# Altium schematic sheet Embarcado.SchDoc
size A4
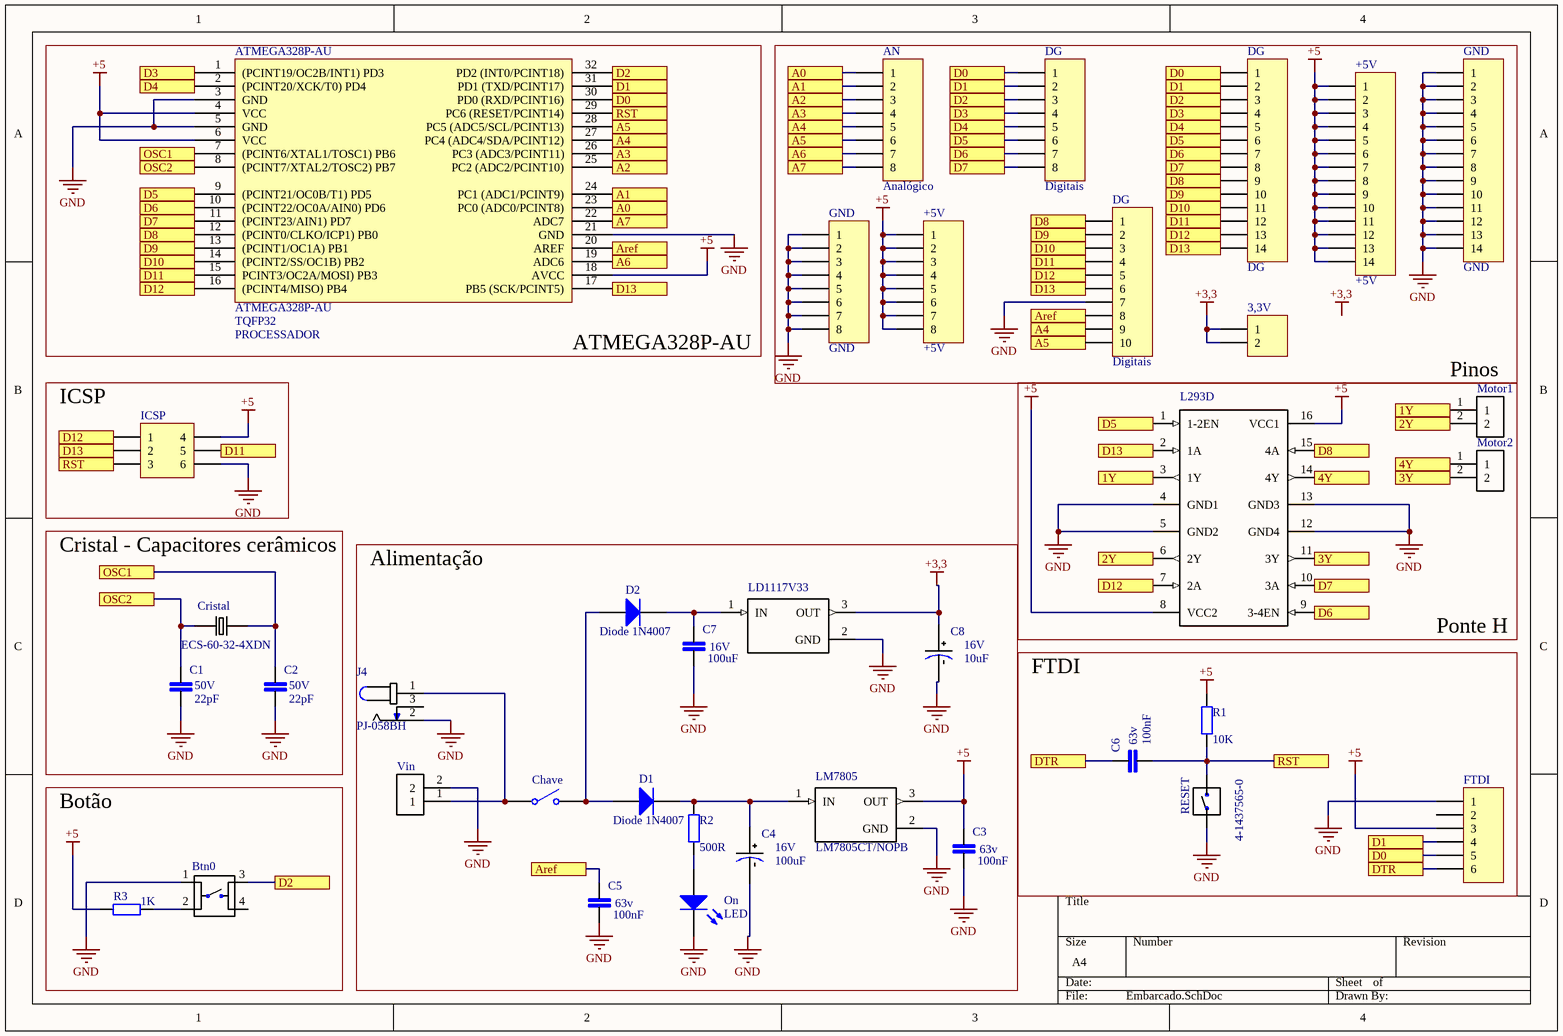
[diagram p0: Embarcado.SchDoc]

## Parts
(Parts that share a designator on the sheet are numbered #1, #2 ... from top to bottom, then left to right.)
3,3V  (no value)  [HDR1X2]
+5V#1  +5V  [HDR1X14]
+5V#2  +5V  [HDR1X8]
AN  Analógico  [HDR1X8]
ATMEGA328P-AU  PROCESSADOR  [TQFP80P900X900X120-32N]
Btn0  (no value)  [SW_FSM8JH]
C1  (no value)  [LEADED_DECOUPLING_CAP(.1)]
C2  (no value)  [LEADED_DECOUPLING_CAP(.1)]
C3  (no value)  [LEADED_DECOUPLING_CAP(.1)]
C4  (no value)  [CAPPRD200W50D500H1100B_ECA-1HM220(Primary)]
C5  (no value)  [LEADED_DECOUPLING_CAP(.1)]
C6  (no value)  [LEADED_DECOUPLING_CAP(.1)]
C7  (no value)  [LEADED_DECOUPLING_CAP(.1)]
C8  (no value)  [CAPPRD200W50D500H1100B_ECA-1HM220(Primary)]
Chave  (no value)  [SPST-2]
Cristal  ECS-60-32-4XDN  [XTAL_ECS-60-32-4XDN]
D1  Diode 1N4007  [DO-41]
D2  Diode 1N4007  [DO-41]
DG#1  Digitais  [HDR1X8]
DG#2  DG  [HDR1X14]
DG#3  Digitais  [HDR1X10]
FTDI  (no value)  [HDR1X6]
GND#1  GND  [HDR1X14]
GND#2  GND  [HDR1X8]
ICSP  (no value)  [HDR2X3_CEN]
J4  PJ-058BH  [CUI_PJ-058BH]
L293D  (no value)  [DIL16]
LD1117V33  (no value)  [TO254P1054X470X2600-3]
LM7805  LM7805CT/NOPB  [TO254P1054X470X2600-3]
Motor1  282837\-2  [TE_282837-2]  (value not drawn)
Motor2  282837\-2  [TE_282837-2]  (value not drawn)
On  LED  [LED-0]
R1  value 10K  [AXIAL-0.4]
R2  value 500R  [AXIAL-0.4]
R3  value 1K  [AXIAL-0.4]
RESET  4-1437565-0  [SW_4-1437565-0]
Vin  282837\-2  [TE_282837-2]  (value not drawn)

## Blocks framed on the sheet
ATMEGA328P-AU: ATMEGA328P-AU
Pinos: 3,3V +5V#1 +5V#2 AN DG#1-DG#3 GND#1 GND#2
ICSP: ICSP
Cristal - Capacitores cerâmicos: C1 C2 Cristal
Alimentação: C3-C5 C7 C8 Chave D1 D2 J4 LD1117V33 LM7805 On R2 Vin
Botão: Btn0 R3

## Ports
1Y, 2Y, 3Y, 4Y, A0, A1, A2, A3, A4, A5, A6, A7, Aref, D0, D1, D2, D3, D4, D5, D6, D7, D8, D9, D10, D11, D12, D13, DTR, OSC1, OSC2, RST

## Nets
+3,3: 3,3V.1 3,3V.2 C8.POS LD1117V33.3(OUT)
+5: +5V#1.1 +5V#1.2 +5V#1.3 +5V#1.4 +5V#1.5 +5V#1.6 +5V#1.7 +5V#1.8 +5V#1.9 +5V#1.10 +5V#1.11 +5V#1.12 +5V#1.13 +5V#1.14 +5V#2.1 +5V#2.2 +5V#2.3 +5V#2.4 +5V#2.5 +5V#2.6 +5V#2.7 +5V#2.8 ATMEGA328P-AU.4(VCC) ATMEGA328P-AU.6(VCC) ATMEGA328P-AU.18(AVCC) C3.1 FTDI.3 ICSP.4 L293D.8(VCC2) L293D.16(VCC1) LM7805.3(OUT) R1.2 R3.2
GND: ATMEGA328P-AU.3(GND) ATMEGA328P-AU.5(GND) ATMEGA328P-AU.21(GND) Btn0.1 C1.2 C2.2 C3.2 C4.NEG C5.2 C7.2 C8.NEG DG#3.7 FTDI.1 GND#1.1 GND#1.2 GND#1.3 GND#1.4 GND#1.5 GND#1.6 GND#1.7 GND#1.8 GND#1.9 GND#1.10 GND#1.11 GND#1.12 GND#1.13 GND#1.14 GND#2.1 GND#2.2 GND#2.3 GND#2.4 GND#2.5 GND#2.6 GND#2.7 GND#2.8 ICSP.6 J4.2 L293D.4(GND1) L293D.5(GND2) L293D.12(GND4) L293D.13(GND3) LD1117V33.2(GND) LM7805.2(GND) On.2(K) RESET.2 Vin.2
1Y: L293D.3(1Y) Motor1.1 ; port 1Y
2Y: L293D.6(2Y) Motor1.2 ; port 2Y
3Y: L293D.11(3Y) Motor2.2 ; port 3Y
4Y: L293D.14(4Y) Motor2.1 ; port 4Y
A0: AN.1 ATMEGA328P-AU.23(PC0_(ADC0/PCINT8)) ; port A0
A1: AN.2 ATMEGA328P-AU.24(PC1_(ADC1/PCINT9)) ; port A1
A2: AN.3 ATMEGA328P-AU.25(PC2_(ADC2/PCINT10)) ; port A2
A3: AN.4 ATMEGA328P-AU.26(PC3_(ADC3/PCINT11)) ; port A3
A4: AN.5 ATMEGA328P-AU.27(PC4_(ADC4/SDA/PCINT12)) DG#3.9 ; port A4
A5: AN.6 ATMEGA328P-AU.28(PC5_(ADC5/SCL/PCINT13)) DG#3.10 ; port A5
A6: AN.7 ATMEGA328P-AU.19(ADC6) ; port A6
A7: AN.8 ATMEGA328P-AU.22(ADC7) ; port A7
Aref: ATMEGA328P-AU.20(AREF) C5.1 DG#3.8 ; port Aref
D0: ATMEGA328P-AU.30(PD0_(RXD/PCINT16)) DG#1.1 DG#2.1 FTDI.5 ; port D0
D1: ATMEGA328P-AU.31(PD1_(TXD/PCINT17)) DG#1.2 DG#2.2 FTDI.4 ; port D1
D2: ATMEGA328P-AU.32(PD2_(INT0/PCINT18)) Btn0.3 DG#1.3 DG#2.3 ; port D2
D3: ATMEGA328P-AU.1((PCINT19/OC2B/INT1)_PD3) DG#1.4 DG#2.4 ; port D3
D4: ATMEGA328P-AU.2((PCINT20/XCK/T0)_PD4) DG#1.5 DG#2.5 ; port D4
D5: ATMEGA328P-AU.9((PCINT21/OC0B/T1)_PD5) DG#1.6 DG#2.6 L293D.1(1-2EN) ; port D5
D6: ATMEGA328P-AU.10((PCINT22/OC0A/AIN0)_PD6) DG#1.7 DG#2.7 L293D.9(3-4EN) ; port D6
D7: ATMEGA328P-AU.11((PCINT23/AIN1)_PD7) DG#1.8 DG#2.8 L293D.10(3A) ; port D7
D8: ATMEGA328P-AU.12((PCINT0/CLKO/ICP1)_PB0) DG#2.9 DG#3.1 L293D.15(4A) ; port D8
D9: ATMEGA328P-AU.13((PCINT1/OC1A)_PB1) DG#2.10 DG#3.2 ; port D9
D10: ATMEGA328P-AU.14((PCINT2/SS/OC1B)_PB2) DG#2.11 DG#3.3 ; port D10
D11: ATMEGA328P-AU.15(PCINT3/OC2A/MOSI)_PB3) DG#2.12 DG#3.4 ICSP.5 ; port D11
D12: ATMEGA328P-AU.16((PCINT4/MISO)_PB4) DG#2.13 DG#3.5 ICSP.1 L293D.7(2A) ; port D12
D13: ATMEGA328P-AU.17(PB5_(SCK/PCINT5)) DG#2.14 DG#3.6 ICSP.2 L293D.2(1A) ; port D13
DTR: C6.2 FTDI.6 ; port DTR
OSC1: ATMEGA328P-AU.7((PCINT6/XTAL1/TOSC1)_PB6) C2.1 Cristal.2 ; port OSC1
OSC2: ATMEGA328P-AU.8((PCINT7/XTAL2/TOSC2)_PB7) C1.1 Cristal.1 ; port OSC2
RST: ATMEGA328P-AU.29(PC6_(RESET/PCINT14)) C6.1 ICSP.3 R1.1 RESET.2 ; port RST
NetBtn0_2: Btn0.2 R3.1
NetC4_POS: C4.POS D1.2(K) LM7805.1(IN) R2.2
NetC7_1: C7.1 D2.2(K) LD1117V33.1(IN)
NetChave_1: Chave.1(COMMON) J4.1 Vin.1
NetChave_2: Chave.2(NO) D1.1(A) D2.1(A)
NetOn_1: On.1(A) R2.1

Not connected (* = marked no-connect by the designer): Btn0 4; FTDI 2; J4 3

## Notes on the sheet
- 16V
- (near C8) 16V
- Ponte H
- (near C1) 22pF
- (near C1) 50V
- (near C2) 22pF
- (near C2) 50V
- 100uF
- (near C8) 10uF
- FTDI
- (near C6) 63v
- (near C6) 100nF
- (near C3) 63v
- (near C5) 100nF
- (near C5) 63v
- (near C3) 100nF
- Labels drawn without touching a wire or pin: +3,3
- (in symbol ATMEGA328P-AU) TQFP32

## Library data of the parts
3,3V = Header 2: Header, 2-Pin; LatestRevisionDate: 17-Jul-2002; LatestRevisionNote: Re-released for DXP Platform.; Publisher: Altium Limited
+5V#1 DG#2 GND#1 = Header 14: Header, 14-Pin; LatestRevisionDate: 17-Jul-2002; LatestRevisionNote: Re-released for DXP Platform.; Publisher: Altium Limited
+5V#2 AN DG#1 GND#2 = Header 8: Header, 8-Pin; LatestRevisionDate: 17-Jul-2002; LatestRevisionNote: Re-released for DXP Platform.; Publisher: Altium Limited
ATMEGA328P-AU = ATMEGA328P-AU: ATMEGA328P-AU, 8 bit AVR Microcontrolador 20MHz 1kB, 32kB Flash, 2kB RAM. I2C 32-Pin TQFP; Datasheet URL: http://ww1.microchip.com/downloads/en/devicedoc/atmel-42735-8-bit-avr-microcontroller-atmega328-328p_datasheet.pdf
Btn0 = FSM8JH: Switch, Pushbutton, Tactile, SPST, Thru Hole, Vertical, 6MM, Black; MF: TE Connectivity / Alcoswitch; MP: FSM8JH; Price: None; Availability: Unavailable; Package: None; SnapEDA_Link: https://www.snapeda.com/parts/FSM8JH/TE%20Connectivity%20/%20Alcoswitch/view-part/?ref=snap; Value: *
C1-C3 C5-C7 = C320C104M1U5TA: Capacitor; Ceramic; Cap .100uF; Tol 20%; Radial; Vol-Rtg 100V; MF: KEMET; Price: None; SnapEDA_Link: https://www.snapeda.com/parts/C320C104M1U5TA/KEMET/view-part/?ref=snap; Availability: Unavailable; MP: C320C104M1U5TA; Package: Radial Kemet; Value: *
C4 C8 = ECA-1HM220: Cap Aluminum 22uF 50V 20% _5 X 11mm_ Radial Aluminum Cylindrical Can 2mm 100mA 2000 hr 85Â°C Bulk; MF: Panasonic; MP: ECA1HM220; Price: None; SnapEDA_Link: https://www.snapeda.com/parts/ECA1HM220/Panasonic/view-part/?ref=snap; Availability: Unavailable; Package: None; Value: *
Chave = SW-SPST: Single-Pole, Single-Throw Switch; Published: 24-Mar-1999; LatestRevisionDate: 17-Jul-2002; LatestRevisionNote: Re-released for DXP Platform.; PackageReference: SPST-2; Publisher: Altium Limited; PackageDescription: Switch; 2 Leads
Cristal = ECS-60-32-4XDN: Crystal 6.0000mhz 32pf t/h; MF: ECS Inc.; Price: None; SnapEDA_Link: https://www.snapeda.com/parts/ECS-60-32-4XDN/ECS%20Inc./view-part/?ref=snap; Availability: Unavailable; MP: ECS-60-32-4XDN; Package: HC-49/US ECS International; Value: *
D1 D2 = Diode 1N4007: 1 Amp General Purpose Rectifier; Published: 8-Jun-2000; LatestRevisionDate: 17-Jul-2002; LatestRevisionNote: Re-released for DXP Platform.; DatasheetVersion: 1998; PackageVersion: Aug-1999; PackageReference: DO-41; Publisher: Altium Limited; PackageDescription: Diode, Axial; Body 5.2 x 2.7 mm (LxDia. max), Lead Dia. 0.86 mm (max); Code_JEDEC: DO-204-AL; ComponentLink1Description: Manufacturer Link; ComponentLink1URL: http://www.fairchildsemi.com/; ComponentLink2Description: Datasheet; ComponentLink2URL: http://www.fairchildsemi.com/ds/1N%2F1N4001.pdf
DG#3 = Header 10: Header, 10-Pin; LatestRevisionDate: 17-Jul-2002; LatestRevisionNote: Re-released for DXP Platform.; Publisher: Altium Limited
FTDI = Header 6: Header, 6-Pin; LatestRevisionDate: 17-Jul-2002; LatestRevisionNote: Re-released for DXP Platform.; Publisher: Altium Limited
ICSP = Header 3X2A: Header, 3-Pin, Dual row; LatestRevisionDate: 17-Jul-2002; LatestRevisionNote: Re-released for DXP Platform.; Publisher: Altium Limited
L293D = L293D: MF: STMicroelectronics; Price: None; SnapEDA_Link: https://www.snapeda.com/parts/L293D/STMicroelectronics/view-part/?ref=snap; Availability: Unavailable; MP: L293D; Package: Package Analog Devices; Value: *
LD1117V33 LM7805 = LM7805CT/NOPB: MF: ON Semiconductor; Price: None; SnapEDA_Link: https://www.snapeda.com/parts/LM7805CT/ON%20Semiconductor/view-part/?ref=snap; Availability: Unavailable; MP: LM7805CT; Package: TO-220 ON Semiconductor; Value: *
Motor1 Motor2 Vin = 282837-2: Connector Terminal Blocks Receptacle 2 Position 5.08mm Solder Straight Thru-Hole 13.5A/Contact; MF: TE Connectivity; Price: None; EU_RoHS_Compliance: Compliant with Exemptions; SnapEDA_Link: https://www.snapeda.com/parts/282837-2/TE%20Connectivity%20AMP%20Connectors/view-part/?ref=snap; Availability: Unavailable; MP: 282837-2; Package: None; Link: http://www.te.com/usa-en/product-282837-2.html; Value: *
On = LED0: Typical INFRARED GaAs LED; Published: 8-Jun-2000; LatestRevisionDate: 08-Jul-2005; LatestRevisionNote: Mech Layer 1 removed.; PackageReference: LED-0; Publisher: Altium Limited; PackageDescription: LED; 2 Leads
R1-R3 = Res2: Resistor; Published: 8-Jun-2000; LatestRevisionDate: 17-Jul-2002; LatestRevisionNote: Re-released for DXP Platform.; PackageReference: AXIAL-0.4; Publisher: Altium Limited; PackageDescription: Axial Device, Thru-Hole; 2 Leads; 0.4 in Pin Spacing
RESET = 4-1437565-0: features, series, Tactile / Jog, circuitry, voltage, illumination, operation, tactile, style, Pushbutton, Industrial ...; MF: TE Connectivity; MP: FSM4JRT; Price: None; SnapEDA_Link: https://www.snapeda.com/parts/FSM4JRT/TE%20Connectivity%20ALCOSWITCH%20Switches/view-part/?ref=snap; Availability: Unavailable; Package: None; Value: *
J4 = PJ-058BH: Value: *